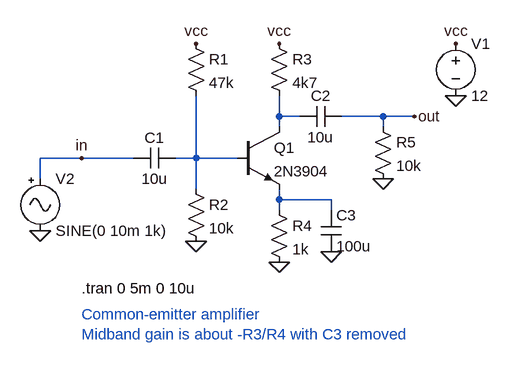
[diagram p0: schematic ce_amplifier.asc]
ce_amplifier.asc, the LTspice schematic file:
Version 4
SHEET 1 880 680
WIRE 0 256 144 256
WIRE 0 288 0 256
WIRE 208 256 240 256
WIRE 240 160 240 304
WIRE 240 256 304 256
WIRE 368 160 368 208
WIRE 368 192 400 192
WIRE 464 192 528 192
WIRE 528 192 576 192
WIRE 528 192 528 208
WIRE 368 304 368 336
WIRE 368 320 448 320
WIRE 448 320 448 336
FLAG 0 368 0
FLAG 64 256 in
FLAG 240 80 vcc
FLAG 368 80 vcc
FLAG 240 384 0
FLAG 368 416 0
FLAG 448 400 0
FLAG 528 288 0
FLAG 576 192 out
FLAG 640 80 vcc
FLAG 640 160 0
SYMBOL Misc\signal 0 272 R0
WINDOW 123 0 0 Left 0
WINDOW 39 0 0 Left 0
SYMATTR InstName V2
SYMATTR Value SINE(0 10m 1k)
SYMBOL cap 208 240 R90
WINDOW 0 0 32 VBottom 2
WINDOW 3 32 32 VTop 2
SYMATTR InstName C1
SYMATTR Value 10u
SYMBOL res 224 64 R0
SYMATTR InstName R1
SYMATTR Value 47k
SYMBOL res 224 288 R0
SYMATTR InstName R2
SYMATTR Value 10k
SYMBOL npn 304 208 R0
SYMATTR InstName Q1
SYMATTR Value 2N3904
SYMBOL res 352 64 R0
SYMATTR InstName R3
SYMATTR Value 4k7
SYMBOL res 352 320 R0
SYMATTR InstName R4
SYMATTR Value 1k
SYMBOL cap 432 336 R0
SYMATTR InstName C3
SYMATTR Value 100u
SYMBOL cap 400 208 R270
WINDOW 0 32 32 VTop 2
WINDOW 3 0 32 VBottom 2
SYMATTR InstName C2
SYMATTR Value 10u
SYMBOL res 512 192 R0
SYMATTR InstName R5
SYMATTR Value 10k
SYMBOL voltage 640 64 R0
SYMATTR InstName V1
SYMATTR Value 12
TEXT 64 456 Left 2 !.tran 0 5m 0 10u
TEXT 64 496 Left 2 ;Common-emitter amplifier\nMidband gain is about -R3/R4 with C3 removed

The netlist it stands for:
* ce_amplifier.asc
V2 in 0 SINE(0 10m 1k)
C1 N001 in 10u
R1 vcc N001 47k
R2 N001 0 10k
Q1 N002 N001 N003 0 2N3904
R3 vcc N002 4k7
R4 N003 0 1k
C3 N003 0 100u
C2 N002 out 10u
R5 out 0 10k
V1 vcc 0 12
.model NPN NPN
.model PNP PNP
.lib standard.bjt
.tran 0 5m 0 10u
* Common-emitter amplifier
* Midband gain is about -R3/R4 with C3 removed
.backanno
.end